# EasyEDA schematic SCH_NFC-Business-Card_2024-06-08.json
TITLE: Sheet_1; REV: 1.0; Date: 2023-05-20; Sheet: 1/1; Drawn By: sahitiaws; Company: Your Company
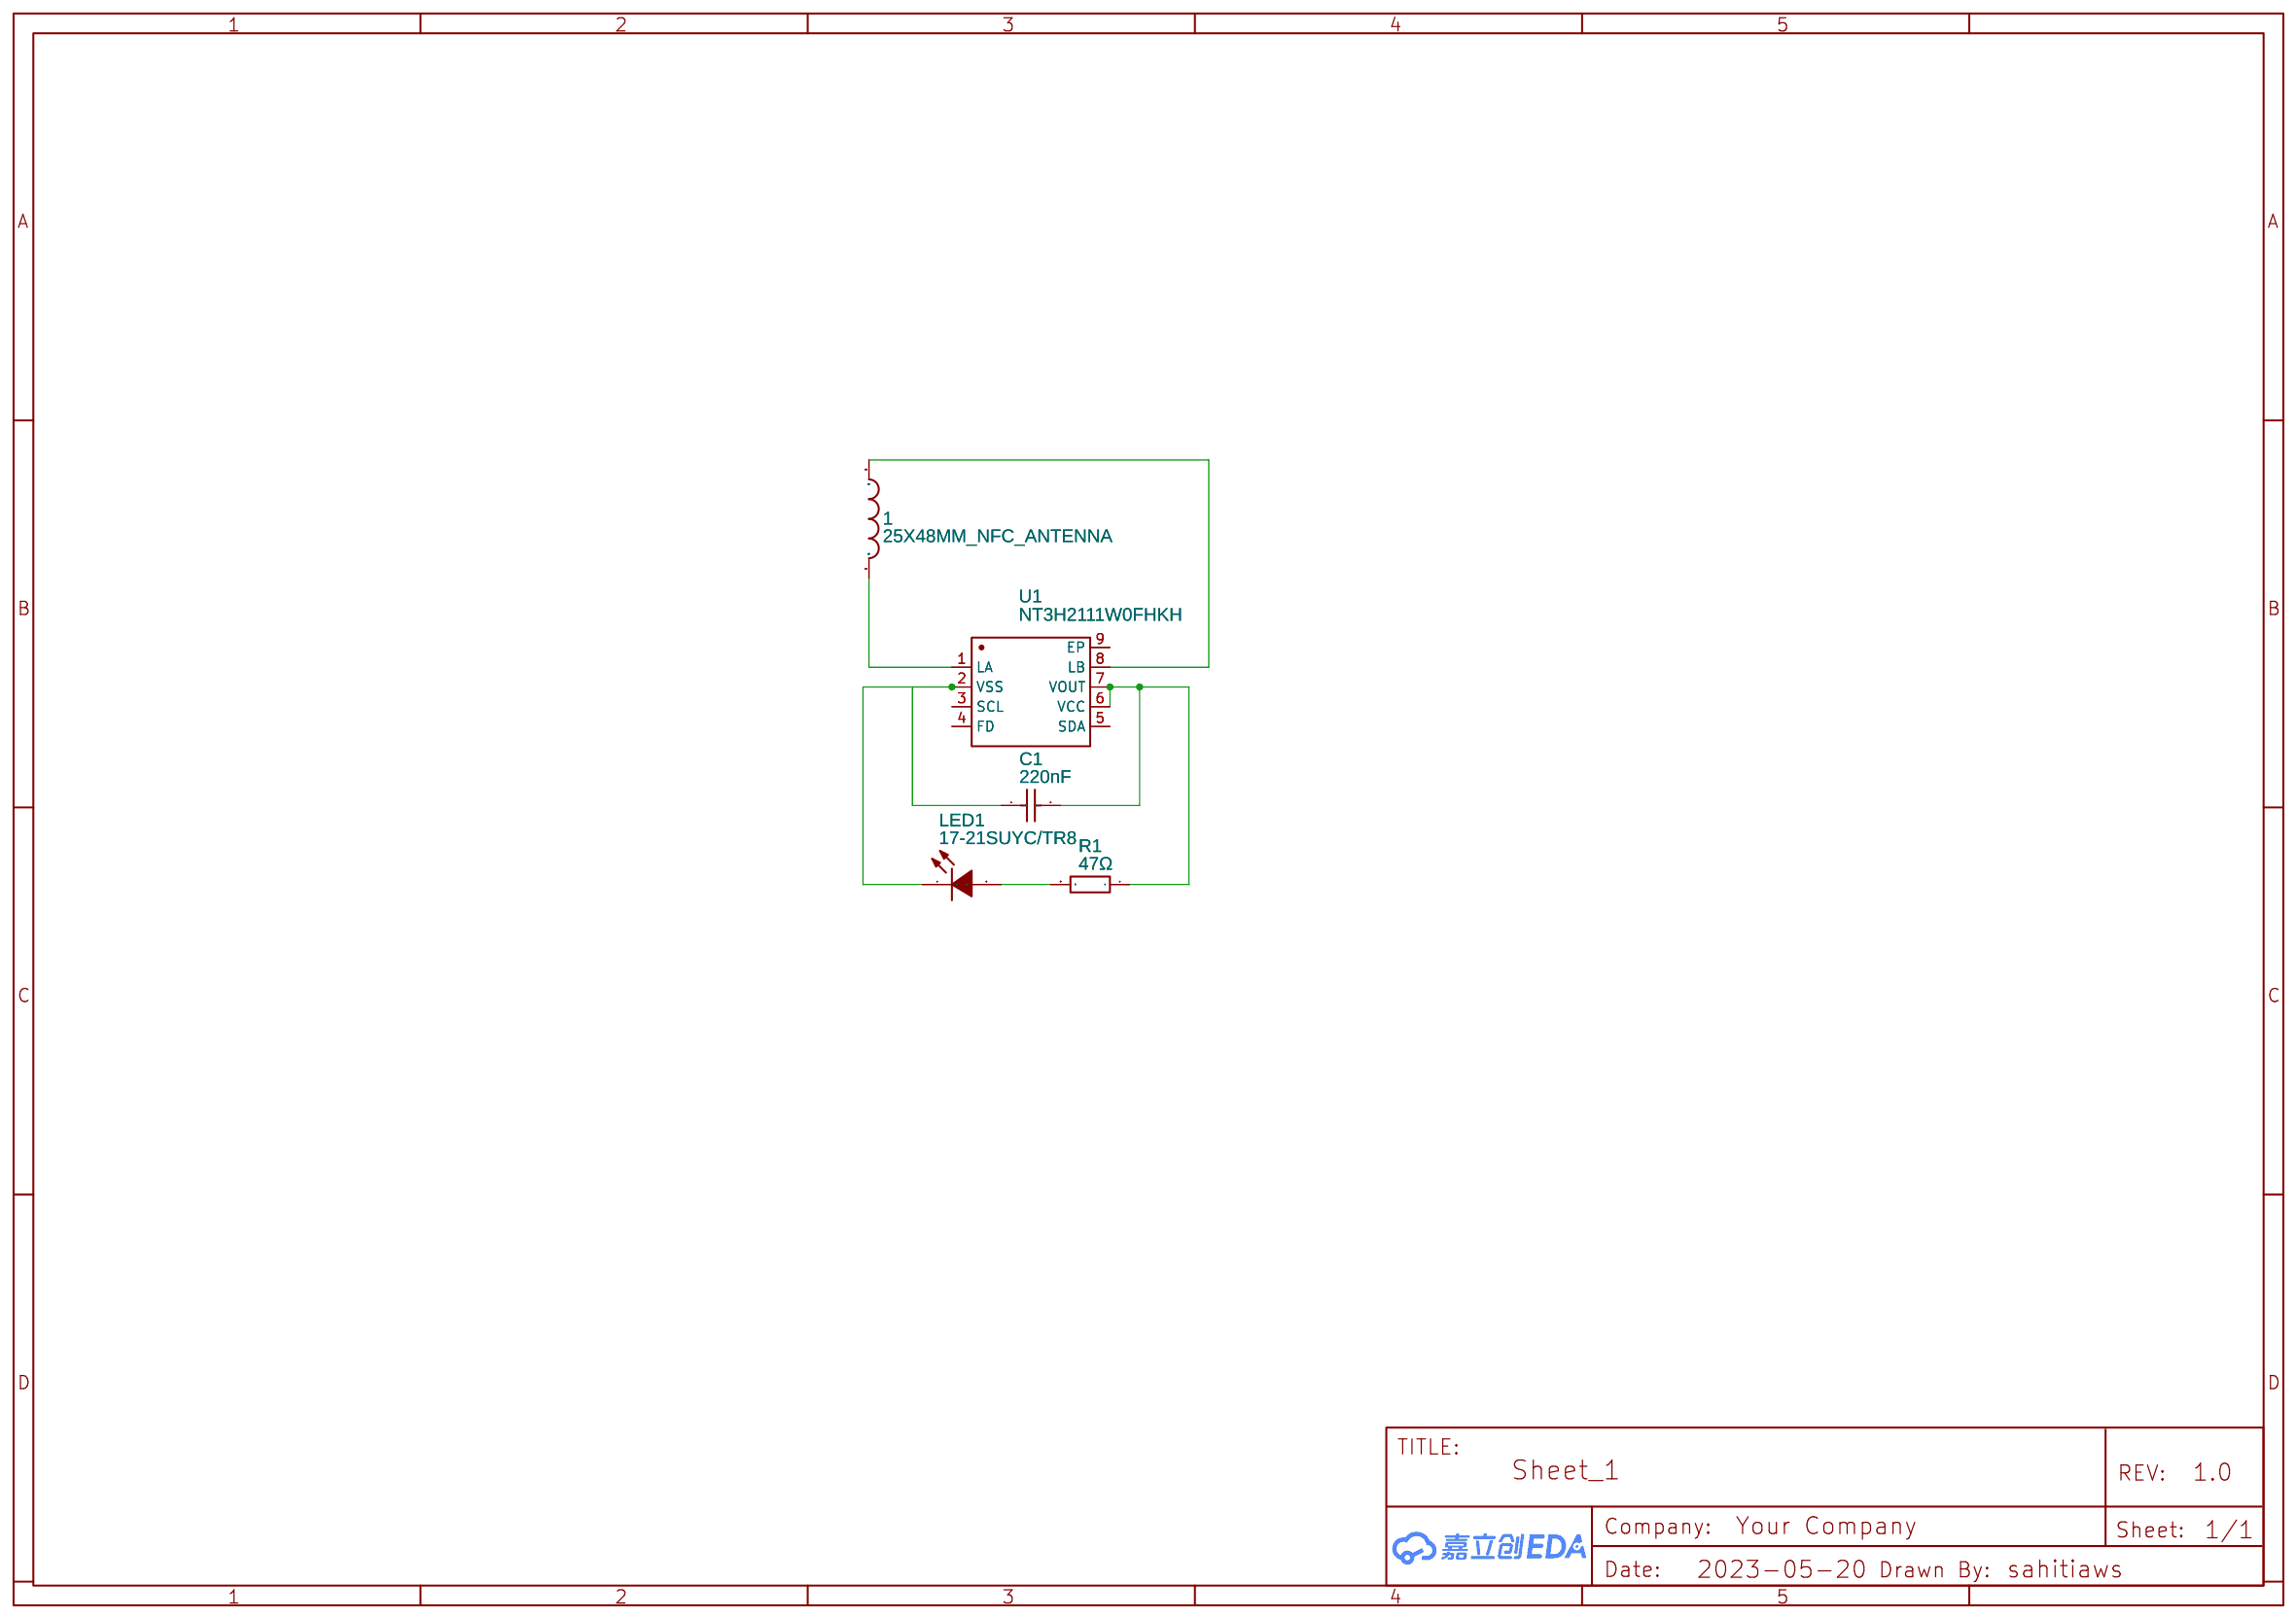
[diagram p0: schematic sheet]

## Parts
1  25X48MM_NFC_ANTENNA  [25X48MM_NFC_ANTENNA]
C1  220nF  [C0603]
LED1  17-21SUYC/TR8  [LED0805-RD]
R1  47Ω  [R0603]
U1  NT3H2111W0FHKH  [XQFN-8_L1.6-W1.6-P0.50-BL]

## Library data of the parts
1 = 25X48MM_NFC_ANTENNA: Contributor: LoneWalkerWolf
C1 = 220N CL10B224KA8NNNC: Supplier: LCSC; Manufacturer Part: CL10B224KA8NNNC; Manufacturer: SAMSUNG; Supplier Part: C21120; JLCPCB Part Class: Basic Part
LED1 = 17-21SUYC/TR8: Supplier: LCSC; Manufacturer: KENTO; image: //image.lceda.cn/szlcsc/C2296.jpg; Supplier Part: C2296; SMT Type: Basic; JLCPCB SMD: Yes; color: yello; Contributor: MegaMy
R1 = 0603WAF470JT5E: Supplier: LCSC; Manufacturer: UniOhm; Supplier Part: C23182; Resistance (Ohms): 47; JLCPCB Part Class: Basic Part; Contributor: eddy.che.su
U1 = NT3H2111W0FHKH: Supplier: LCSC; Supplier Part: C710403; Manufacturer: NXP(恩智浦); JLCPCB Part Class: Extended Part; Contributor: LCSC

## Nets
Net-(1-P$1): 1.P$1 U1.8(LB)
Net-(1-P$2): 1.P$2 U1.1(LA)
Net-(C1-1): C1.1 LED1.1(-) U1.2(VSS)
Net-(C1-2): C1.2 R1.1 U1.6(VCC) U1.7(VOUT)
Net-(LED1-2): LED1.2(+) R1.2

Not connected (* = marked no-connect by the designer): U1 3(SCL) 4(FD) 5(SDA) 9(EP)
